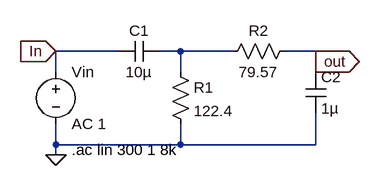
[diagram p0: schematic 5.Band Pass Filter.asc]
5.Band Pass Filter.asc, the LTspice schematic file:
Version 4
SHEET 1 880 680
WIRE 128 64 32 64
WIRE 224 64 192 64
WIRE 304 64 224 64
WIRE 432 64 384 64
WIRE 432 80 432 64
WIRE 32 96 32 64
WIRE 224 96 224 64
WIRE 432 96 432 80
WIRE 32 208 32 176
WIRE 224 208 224 176
WIRE 224 208 32 208
WIRE 432 208 432 160
WIRE 432 208 224 208
WIRE 32 224 32 208
FLAG 32 224 0
FLAG 32 64 In
IOPIN 32 64 In
FLAG 432 80 out
IOPIN 432 80 Out
SYMBOL voltage 32 80 R0
SYMATTR InstName Vin
SYMATTR Value AC 1
SYMBOL cap 192 48 R90
WINDOW 0 0 32 VBottom 2
WINDOW 3 32 32 VTop 2
SYMATTR InstName C1
SYMATTR Value 10µ
SYMBOL res 208 80 R0
SYMATTR InstName R1
SYMATTR Value 122.4
SYMBOL res 400 48 R90
WINDOW 0 0 56 VBottom 2
WINDOW 3 32 56 VTop 2
SYMATTR InstName R2
SYMATTR Value 79.57
SYMBOL cap 416 96 R0
SYMATTR InstName C2
SYMATTR Value 1µ
TEXT 56 216 Left 2 !.ac lin 300 1 8k

The netlist it stands for:
* 5.Band Pass Filter.asc
Vin In 0 AC 1
C1 N001 In 10µ
R1 N001 0 122.4
R2 out N001 79.57
C2 out 0 1µ
.ac lin 300 1 8k
.backanno
.end